# EAGLE schematic Sterownik_pralnia (EAGLE 9.6.2)
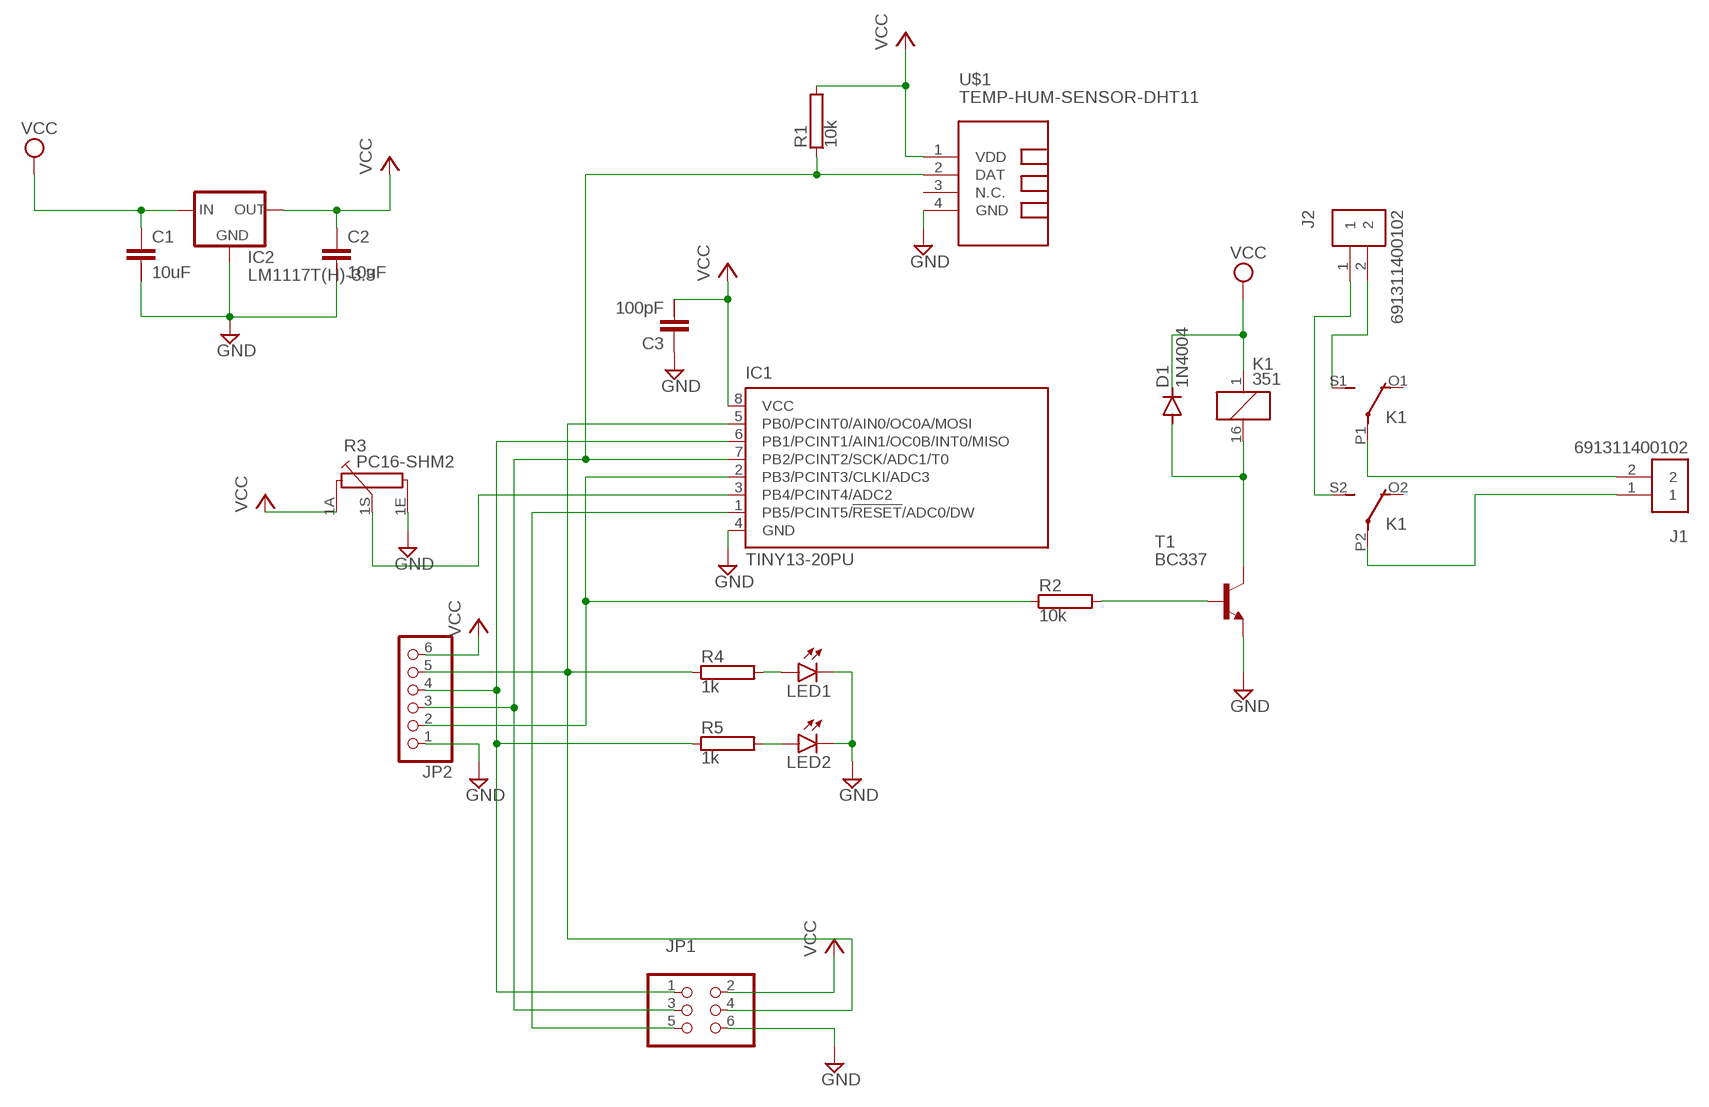
[diagram p0: schematic, sheet 1]

## Parts
C1  10uF  C-2.5-5/2  [C2.5/5-2]
C2  10uF  C-2.5-5/2  [C2.5/5-2]
C3  100pF  C-2.5-5/2  [C2.5/5-2]
D1  1N4004  [DO41-10]
IC1  TINY13-20PU  [DIL08]
IC2  LM1117T(H)-3.3  [TO220H]
J1  691311400102  [TERMINALBLOCK_PLUGGABLE-2-7.62MM]
J2  691311400102  [TERMINALBLOCK_PLUGGABLE-2-7.62MM]
JP1  PINHD-2X3  [2X03]
JP2  PINHD-1X6  [1X06]
K1  351  [351]
LED1  LEDB152  [Q62902-B152]
LED2  LEDB152  [Q62902-B152]
R1  10k  RAC01  [AC01]
R2  10k  RAC01  [AC01]
R3  PC16-SHM2  [PC16-SHM2]
R4  1k  RAC01  [AC01]
R5  1k  RAC01  [AC01]
T1  BC337  [TO92]
U$1  TEMP-HUM-SENSOR-DHT11  [TEMP-HUM-SENSOR-DHT11]

## Nets
GND: C1.2 C2.2 C3.1 IC1.4(GND) IC2.1(GND) JP1.6 JP2.1 LED1.K(C) LED2.K(C) R3.1E T1.1(E) U$1.4(GND)
N$1: R2.2 T1.2(B)
N$2: IC1.2(PB3/PCINT3/CLKI/ADC3) JP2.2 R2.1
N$4: IC1.6(PB1/PCINT1/AIN1/OC0B/INT0/MISO) JP1.1 JP2.4 R5.1
N$5: D1.A K1.16 T1.3(C)
N$6: IC1.3(PB4/PCINT4/ADC2) R3.1S
N$7: IC1.7(PB2/PCINT2/SCK/ADC1/T0) JP1.3 JP2.3 R1.1 U$1.2(DAT)
N$8: IC1.1(PB5/PCINT5/!RESET!/ADC0/DW) JP1.5
N$9: J1.2 K1.P1(2:P)
N$10: J1.1 K1.P2(3:P)
N$11: J2.2 K1.S1(2:S)
N$12: J2.1 K1.S2(3:S)
N$13: IC1.5(PB0/PCINT0/AIN0/OC0A/MOSI) JP1.4 JP2.5 R4.1
N$14: LED1.A R4.2
N$15: LED2.A R5.2
VCC: C1.1 C2.1 C3.2 D1.C IC1.8(VCC) IC2.2(OUT) IC2.3(IN) JP1.2 JP2.6 K1.1 R1.2 R3.1A U$1.1(VDD)
Unconnected: C1.3 C2.3 C3.3 K1.O1(2:O) K1.O2(3:O) R3.M1 R3.M2 R3.M3 R3.M4 U$1.3(N.C.)

## Library data of the parts
C1-C3 = capacitor-wima:C-: CAPACITOR for alternative placement naming: default grid - extended grid/package width
D1 = diode:1N4004: DIODE general purpose rectifier, 1 A
IC1 = atmel:TINY13: 8-bit AVR Microcontroller with 1K Bytes In-System Programmable Flash Source: http://www.atmel.com/dyn/resources/prod_documents/2535S.pdf; MPN: ATTINY13-20PU; OC_FARNELL: 9171550; OC_NEWARK: 96K6521
IC2 = lm1117_11:LM1117?-*: 800mA Low-Dropout Linear Regulator Source: http://www.ti.com/lit/ds/symlink/lm1117-n.pdf; MF: Texas Instruments; MPN: LM1117T-3.3; OC_FARNELL: 1469056; OC_NEWARK: 13B5347
J1 J2 = Terminal Blocks:691311400102: 7.62MM CLOSE VERTICAL PCB HEADER WR-TBL Manufacturer's datasheet <https://katalog.we-online.com/em/datasheet/6913114001xx.pdf>; CREATED_BY: PCBLayout.com; DIGIKEY_PART_NO: 732-2823-ND; MANUFACTURER: WURTH ELEKTRONIK; MPN: 691311400102
JP1 = pinhead:PINHD-2X3: PIN HEADER
JP2 = pinhead:PINHD-1X6: PIN HEADER
K1 = relay:351: RELAY 2 x switch, Omron; OC_FARNELL: unknown; OC_NEWARK: unknown
LED1 LED2 = led:LED: LED OSRAM: - CHIPLED LG R971, LG N971, LY N971, LG Q971, LY Q971, LO R971, LY R971 LH N974, LH R974 LS Q976, LO Q976, LY Q976 LO Q996 - Hyper CHIPLED LW Q18S LB Q993, LB Q99A, LB R99A - SideLED LS A670, LO A670, LY A670, LG A670, LP A670 LB A673, LV A673, LT A673, LW A673 LH A674 LY A675 LS A676, LA A676, LO A676, LY A676, LW A676 LS A679, LY A679, LG A679 - Hyper Micro SIDELED® LS Y876, LA Y876, LO Y876, LY Y876 LT Y87S - SmartLED LW L88C, LW L88S LB L89C, LB L89S, LG L890 LS L89K, LO L89K, LY L89K LS L896, LA L896, LO L896, LY L896 - TOPLED LS T670, LO T670, LY T670, LG T670, LP T670 LSG T670, LSP T670, LSY T670, LOP T670, LYG T670 LG T671, LOG T671, LSG T671 LB T673, LV T673, LT T673, LW T673 LH T674 LS T676, LA T676, LO T676, LY T676, LB T676, LH T676, LSB T676, LW T676 LB T67C, LV T67C, LT T67C, LS T67K, LO T67K, LY T67K, LW E67C LS E67B, LA E67B, LO E67B, LY E67B, LB E67C, LV E67C, LT E67C LW T67C LS T679, LY T679, LG T679 LS T770, LO T770, LY T770, LG T770, LP T770 LB T773, LV T773, LT T773, LW T773 LH T774 LS E675, LA E675, LY E675, LS T675 LS T776, LA T776, LO T776, LY T776, LB T776 LHGB T686 LT T68C, LB T68C - Hyper Mini TOPLED® LB M676 - Mini TOPLED Santana® LG M470 LS M47K, LO M47K, LY M47K Source: http://www.osram.convergy.de LUXEON: - LUMILED® LXK2-PW12-R00, LXK2-PW12-S00, LXK2-PW14-U00, LXK2-PW14-V00 LXK2-PM12-R00, LXK2-PM12-S00, LXK2-PM14-U00 LXK2-PE12-Q00, LXK2-PE12-R00, LXK2-PE12-S00, LXK2-PE14-T00, LXK2-PE14-U00 LXK2-PB12-K00, LXK2-PB12-L00, LXK2-PB12-M00, LXK2-PB14-N00, LXK2-PB14-P00, LXK2-PB14-Q00 LXK2-PR12-L00, LXK2-PR12-M00, LXK2-PR14-Q00, LXK2-PR14-R00 LXK2-PD12-Q00, LXK2-PD12-R00, LXK2-PD12-S00 LXK2-PH12-R00, LXK2-PH12-S00 LXK2-PL12-P00, LXK2-PL12-Q00, LXK2-PL12-R00 Source: www.luxeon.com KINGBRIGHT: KA-3528ASYC Source: www.kingbright.com
R1 R2 R4 R5 = resistor-power:R: Power Resitor; OC_FARNELL: unknown; OC_NEWARK: unknown
R3 = piher:PC16-SHM2: POTENTIOMETER single carbon potentiometer, 16 mm, S3ROH; OC_FARNELL: unknown; OC_NEWARK: unknown
T1 = transistor:BC337: NPN TRANSISTOR
U$1 = diy-modules:TEMP-HUM-SENSOR-DHT11: DHT11 - digital humidity & temperature sensor DHT11 datasheet available here: https://akizukidenshi.com/download/ds/aosong/DHT11.pdf Click here to find device on ebay.com <http://www.ebay.com/sch/dht11+digital+sensor>